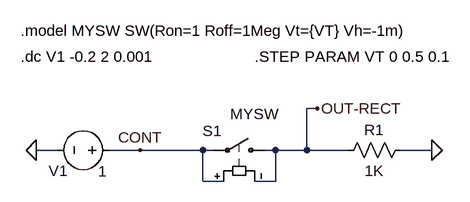
[diagram p0: schematic Fig_2-138_Vswitch_Level1_RECT_VT.asc]
Fig_2-138_Vswitch_Level1_RECT_VT.asc, the LTspice schematic file:
Version 4
SHEET 1 1276 840
WIRE 384 272 368 272
WIRE -16 336 -48 336
WIRE 112 336 64 336
WIRE 208 336 112 336
WIRE 224 336 208 336
WIRE 320 336 304 336
WIRE 368 336 368 272
WIRE 368 336 320 336
WIRE 432 336 368 336
WIRE 560 336 512 336
WIRE 208 384 208 336
WIRE 240 384 208 384
WIRE 320 384 320 336
WIRE 320 384 288 384
FLAG 560 336 0
FLAG -48 336 0
FLAG 384 272 OUT-RECT
FLAG 112 336 CONT
SYMBOL sw 320 336 M270
WINDOW 0 30 112 VLeft 2
WINDOW 3 56 70 VLeft 2
SYMATTR InstName S1
SYMATTR Value MYSW
SYMBOL voltage 80 336 R90
WINDOW 3 33 19 VRight 2
WINDOW 0 32 109 VLeft 2
WINDOW 123 0 0 Left 2
WINDOW 39 0 0 Left 2
SYMATTR Value 1
SYMATTR InstName V1
SYMBOL res 416 352 R270
WINDOW 0 32 56 VTop 2
WINDOW 3 0 56 VBottom 2
SYMATTR InstName R1
SYMATTR Value 1K
TEXT -72 152 Left 2 !.model MYSW SW(Ron=1 Roff=1Meg Vt={VT} Vh=-1m)
TEXT -72 192 Left 2 !.dc V1 -0.2 2 0.001
TEXT 288 192 Left 2 !.STEP PARAM VT 0 0.5 0.1

The netlist it stands for:
* Fig_2-138_Vswitch_Level1_RECT_VT.asc
S1 OUT-RECT CONT CONT OUT-RECT MYSW
V1 CONT 0 1
R1 OUT-RECT 0 1K
.model MYSW SW(Ron=1 Roff=1Meg Vt={VT} Vh=-1m)
.dc V1 -0.2 2 0.001
.STEP PARAM VT 0 0.5 0.1
.backanno
.end